# Altium schematic sheet Sheet1.SchDoc
size A4
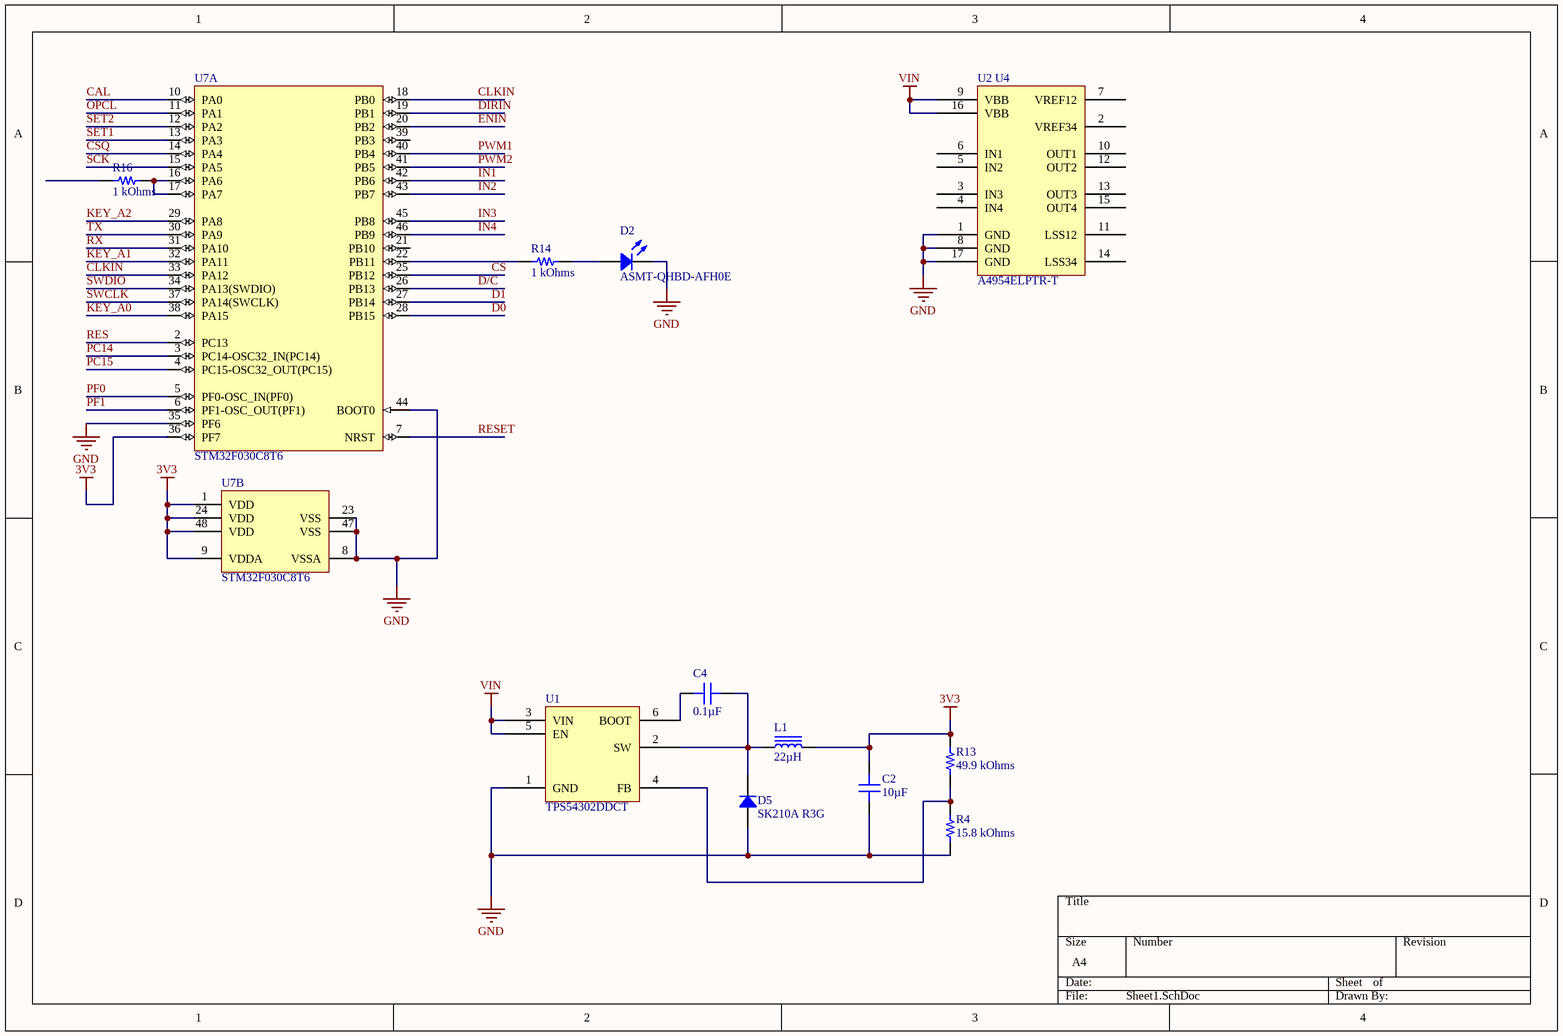
[diagram p0: Sheet1.SchDoc]

## Parts
C2  10µF  [CAP 0805_2012]
C4  0.1µF  [CAP 0805_2012]
D2  ASMT-QHBD-AFH0E  [Broadcom 4-PLLC 3228]
D5  SK210A R3G  [DO214AC SMA]
L1  22µH  [TDK VLCF4024-2]
R4  15.8 kOhms  [RES 0805_2012]
R13  49.9 kOhms  [RES 0805_2012]
R14  1 kOhms  [RES 0805_2012]
R16  1 kOhms  [RES 0805_2012]
U1  TPS54302DDCT  [TI SOT-23-6 DDC]
U2_U4  A4954ELPTR-T  [ALLEGRO TSSOP-16EP LP]
U7  STM32F030C8T6  [STM-LQFP48_N]  (parts A,B of 2)

## Nets
3V3: C2.2 L1.2 R13.2 U7.1(VDD) U7.9(VDDA) U7.24(VDD) U7.36(PF7) U7.48(VDD)
GND: C2.1 D2.2 D5.1 R4.1 U1.1(GND) U2_U4.1(GND) U2_U4.8(GND) U2_U4.17(GND) U7.8(VSSA) U7.23(VSS) U7.35(PF6) U7.44(BOOT0) U7.47(VSS)
VIN: U1.3(VIN) U1.5(EN) U2_U4.9(VBB) U2_U4.16(VBB)
CAL: U7.10(PA0)
CLKIN: U7.18(PB0) U7.33(PA12)
CS: U7.25(PB12)
CSQ: U7.14(PA4)
D0: U7.28(PB15)
D1: U7.27(PB14)
D/C: U7.26(PB13)
DIRIN: U7.19(PB1)
ENIN: U7.20(PB2)
IN1: U7.42(PB6)
IN2: U7.43(PB7)
IN3: U7.45(PB8)
IN4: U7.46(PB9)
KEY_A0: U7.38(PA15)
KEY_A1: U7.32(PA11)
KEY_A2: U7.29(PA8)
OPCL: U7.11(PA1)
PC14: U7.3(PC14-OSC32_IN(PC14))
PC15: U7.4(PC15-OSC32_OUT(PC15))
PF0: U7.5(PF0-OSC_IN(PF0))
PF1: U7.6(PF1-OSC_OUT(PF1))
PWM1: U7.40(PB4)
PWM2: U7.41(PB5)
RES: U7.2(PC13)
RESET: U7.7(NRST)
RX: U7.31(PA10)
SCK: U7.15(PA5)
SET1: U7.13(PA3)
SET2: U7.12(PA2)
SWCLK: U7.37(PA14(SWCLK))
SWDIO: U7.34(PA13(SWDIO))
TX: U7.30(PA9)
NetC4_1: C4.1 U1.6(BOOT)
NetC4_2: C4.2 D5.2 L1.1 U1.2(SW)
NetD2_1: D2.1 R14.2
NetR4_2: R4.2 R13.1 U1.4(FB)
NetR14_1: R14.1 U7.22(PB11)
NetR16_2: R16.2 U7.16(PA6) U7.17(PA7)

Not connected (* = marked no-connect by the designer): R16 1; U2_U4 2(VREF34) 3(IN3) 4(IN4) 5(IN2) 6(IN1) 7(VREF12) 10(OUT1) 11(LSS12) 12(OUT2) 13(OUT3) 14(LSS34) 15(OUT4); U7 21(PB10) 39(PB3)

## Library data of the parts
C2 = C2012JB1E106M085AC: CAP CER 10UF 25V JB 0805; Manufacturer: TDK Corporation; Tolerance: ±20%; Part Number: C2012JB1E106M085AC; Value: 10µF; Applications: General Purpose; Capacitance: 10µF; ComponentLink1Description: Datasheet; ComponentLink1URL: https://product.tdk.com/info/en/catalog/datasheets/mlcc_commercial_general_en.pdf?ref_disty=digikey; ComponentLink2Description: DigiKey Link; ComponentLink2URL: http://digikey.com/product-detail/en/tdk-corporation/C2012JB1E106M085AC/445-11464-1-ND/3953130; Device Package: 0805 (2012 Metric); Features: Low ESL; LastUpdated: 2. 09. 2020 01:04:29; Lifecycle Status: Active; Minimum Order: 1; Mounting Type: Surface Mount, MLCC; Operating Temperature: -25°C ~ 85°C; Package / Case: 0805 (2012 Metric); Packaging: TapeAndReel; PartId: 9643; Part Status: Active; Price: 0.15; Series: C; Size / Dimension: 0.079" L x 0.049" W (2.00mm x 1.25mm); Supplier 1: DigiKey; Supplier Part Number 1: 445-11464-1-ND; Temperature Coefficient: JB; Thickness (Max): 0.037" (0.95mm); Voltage - Rated: 25V
C4 = CC0805MRX7R9BB104: CAP CER 0.1UF 50V X7R 0805; Manufacturer: Yageo; Tolerance: ±20%; Part Number: CC0805MRX7R9BB104; Value: 0.1µF; Applications: General Purpose; Capacitance: 0.1µF; ComponentLink1Description: Datasheet; ComponentLink1URL: https://www.yageo.com/upload/media/product/productsearch/datasheet/mlcc/UPY-GPHC_X7R_6.3V-to-50V_18.pdf; ComponentLink2Description: DigiKey Link; ComponentLink2URL: http://digikey.com/product-detail/en/yageo/CC0805MRX7R9BB104/311-4351-1-ND/8025440; Device Package: 0805 (2012 Metric); LastUpdated: 2. 09. 2020 01:04:42; Lifecycle Status: Active; Minimum Order: 1; Mounting Type: Surface Mount, MLCC; Operating Temperature: -55°C ~ 125°C; Package / Case: 0805 (2012 Metric); Packaging: TapeAndReel; PartId: 2475; Part Status: Active; Price: 0.02; Series: CC; Size / Dimension: 0.079" L x 0.049" W (2.00mm x 1.25mm); Supplier 1: DigiKey; Supplier Part Number 1: 311-4351-1-ND; Temperature Coefficient: X7R; Thickness (Max): 0.037" (0.95mm); Voltage - Rated: 50V
D2 = ASMT-QHBD-AFH0E: LED INDICATOR 0.5W RED/ORN 4PLCC; Manufacturer: Broadcom Limited; Color: Red; Current - Max: 300mA; Current - Test: 150mA; Flux @ Current/Temperature - Test: 24lm (15lm ~ 33lm); Lumens/Watt @ Current - Test: 64 lm/W; Temperature - Test: 25°C; Viewing Angle: 120°; Voltage - Forward (Vf) (Typ): 2.5V; Wavelength: 618nm (611nm ~ 625nm); Part Number: ASMT-QHBD-AFH0E; ComponentLink1Description: Datasheet; ComponentLink1URL: https://docs.broadcom.com/docs/AV02-1841EN; ComponentLink2Description: DigiKey Link; ComponentLink2URL: http://digikey.com/product-detail/en/broadcom-limited/ASMT-QHBD-AFH0E/516-2951-1-ND/4240266; Device Package: 4-PLCC; Height - Seated (Max): 0.083" (2.10mm); LastUpdated: 24. 04. 2020 00:57:17; Lifecycle Status: Active; Minimum Order: 1; Mounting Type: Surface Mount; Package / Case: 4-PLCC; Packaging: TapeAndReel; Part Status: Active; Price: 0.42; Size / Dimension: 0.126" L x 0.110" W (3.20mm x 2.80mm); Supplier 1: DigiKey; Supplier Part Number 1: 516-2951-1-ND; Supplier Device Package: 4-PLCC
D5 = SK210A R3G: DIODE SCHOTTKY 100V 2A DO214AC; Manufacturer: Taiwan Semiconductor Corporation; Current - Reverse Leakage @ Vr: 100µA @ 100V; Speed: Fast Recovery =< 500ns, > 200mA (Io); Voltage - Forward (Vf) (Max) @ If: 850mV @ 2A; Part Number: SK210A R3G; ComponentLink1Description: Datasheet; ComponentLink1URL: https://www.taiwansemi.com/products/datasheet/SK22A%20SERIES_P15.pdf; ComponentLink2Description: DigiKey Link; ComponentLink2URL: http://digikey.com/product-detail/en/taiwan-semiconductor-corporation/SK210A-R3G/SK210AR3GCT-ND/7358622; Current - Average Rectified (Io): 2A; Diode Type: Schottky; LastUpdated: 2. 09. 2020 01:19:02; Lifecycle Status: Active; Minimum Order: 1; Mounting Type: Surface Mount; Operating Temperature - Junction: -55°C ~ 150°C; Package / Case: DO-214AC, SMA; Packaging: TapeAndReel; PartId: 2157; Part Status: Active; Price: 0.11; Series: -; Supplier 1: DigiKey; Supplier Part Number 1: SK210AR3GCT-ND; Supplier Device Package: DO-214AC (SMA); Voltage - DC Reverse (Vr) (Max): 100V
L1 = VLCF5024T-220MR59-2: FIXED IND 22UH 590MA 188 MOHM; Manufacturer: TDK Corporation; DC Resistance (DCR): 188mOhm Max; Inductance Frequency - Test: 100kHz; Material - Core: Ferrite; Shielding: Shielded; Tolerance: ±20%; Type: Wirewound; Part Number: VLCF5024T-220MR59-2; ComponentLink1Description: Datasheet; ComponentLink1URL: https://product.tdk.com/info/en/catalog/datasheets/inductor_commercial_power_vlcf5024-2_en.pdf?ref_disty=digikey; ComponentLink2Description: DigiKey Link; ComponentLink2URL: http://digikey.com/product-detail/en/tdk-corporation/VLCF5024T-220MR59-2/445-8743-1-ND/3083314; Current Rating (Amps): 590mA; Current - Saturation: 590mA; Device Package: Nonstandard; Height - Seated (Max): 0.094" (2.40mm); Inductance: 22µH; LastUpdated: 2. 09. 2020 01:22:15; Lifecycle Status: Active; Minimum Order: 1; Mounting Type: Surface Mount; Operating Temperature: -40°C ~ 105°C; Package / Case: Nonstandard; Packaging: TapeAndReel; PartId: 162; Part Status: Active; Price: 0.63; Series: VLCF; Size / Dimension: 0.197" L x 0.197" W (5.00mm x 5.00mm); Supplier 1: DigiKey; Supplier Part Number 1: 445-8743-1-ND; Value: 22µH
R4 = ERA-6AEB1582V: RES 15.8K OHM 0.1% 1/8W 0805; Manufacturer: Panasonic Electronic Components; Power (Watts): 0.125W, 1/8W; Temperature Coefficient: ±25ppm/°C; Part Number: ERA-6AEB1582V; Value: 15.8 kOhms; ComponentLink1Description: Datasheet; ComponentLink1URL: https://industrial.panasonic.com/cdbs/www-data/pdf/RDM0000/AOA0000C307.pdf; ComponentLink2Description: DigiKey Link; ComponentLink2URL: http://digikey.com/product-detail/en/panasonic-electronic-components/ERA-6AEB1582V/P15.8KDACT-ND/3074972; Composition: Thin Film; Device Package: 0805 (2012 Metric); Features: Automotive AEC-Q200; Height - Seated (Max): 0.024" (0.60mm); LastUpdated: 2. 09. 2020 01:15:23; Lifecycle Status: Active; Minimum Order: 1; Number of Terminations: 2; Operating Temperature: -55°C ~ 155°C; Package / Case: 0805 (2012 Metric); Packaging: TapeAndReel; PartId: 28189; Part Status: Active; Price: 0.04; Ratings: AEC-Q200; Resistance: 15.8 kOhms; Series: ERA-6A; Size / Dimension: 0.079" L x 0.049" W (2.00mm x 1.25mm); Supplier 1: DigiKey; Supplier Part Number 1: P15.8KDACT-ND; Supplier Device Package: 0805; Tolerance: ±0.1%
R13 = 6-2176093-6: RES SMD 49.9K OHM 0.1% 1/4W 0805; Manufacturer: TE Connectivity Passive Product; Power (Watts): 0.25W, 1/4W; Temperature Coefficient: ±25ppm/°C; Part Number: 6-2176093-6; Value: 49.9 kOhms; ComponentLink1Description: Datasheet; ComponentLink1URL: https://www.te.com/commerce/DocumentDelivery/DDEController?Action=srchrtrv&DocNm=1773272&DocType=DS&DocLang=English; ComponentLink2Description: DigiKey Link; ComponentLink2URL: http://digikey.com/product-detail/en/te-connectivity-passive-product/6-2176093-6/A110706CT-ND/4035061; Composition: Thin Film; Device Package: 0805 (2012 Metric); Height - Seated (Max): 0.026" (0.65mm); LastUpdated: 2. 09. 2020 01:15:22; Lifecycle Status: Active; Minimum Order: 1; Number of Terminations: 2; Operating Temperature: -55°C ~ 155°C; Package / Case: 0805 (2012 Metric); Packaging: TapeAndReel; PartId: 28500; Part Status: Active; Price: 0.14; Resistance: 49.9 kOhms; Series: RP73P, Holsworthy; Size / Dimension: 0.079" L x 0.049" W (2.00mm x 1.25mm); Supplier 1: DigiKey; Supplier Part Number 1: A110706CT-ND; Supplier Device Package: 0805; Tolerance: ±0.1%
R14 R16 = CPF0805B1K0E: RES SMD 1K OHM 0.1% 1/10W 0805; Manufacturer: TE Connectivity Passive Product; Power (Watts): 0.1W, 1/10W; Temperature Coefficient: ±25ppm/°C; Part Number: CPF0805B1K0E; Value: 1 kOhms; ComponentLink1Description: Datasheet; ComponentLink1URL: https://www.te.com/commerce/DocumentDelivery/DDEController?Action=srchrtrv&DocNm=1773200&DocType=DS&DocLang=English; ComponentLink2Description: DigiKey Link; ComponentLink2URL: http://digikey.com/product-detail/en/te-connectivity-passive-product/CPF0805B1K0E/A106044CT-ND/3477681; Composition: Thin Film; Device Package: 0805 (2012 Metric); Height - Seated (Max): 0.026" (0.65mm); LastUpdated: 2. 09. 2020 01:15:24; Lifecycle Status: Active; Minimum Order: 1; Number of Terminations: 2; Operating Temperature: -55°C ~ 155°C; Package / Case: 0805 (2012 Metric); Packaging: TapeAndReel; PartId: 27725; Part Status: Active; Price: 0.09; Resistance: 1 kOhms; Series: CPF, Neohm; Size / Dimension: 0.079" L x 0.049" W (2.00mm x 1.25mm); Supplier 1: DigiKey; Supplier Part Number 1: A106044CT-ND; Supplier Device Package: 0805; Tolerance: ±0.1%
U1 = TPS54302DDCT: IC REG BUCK ADJ 3A TSOT23-6; Manufacturer: Texas Instruments; Frequency - Switching: 400kHz; Function: Step-Down; Number of Outputs: 1; Output Configuration: Positive; Output Type: Adjustable; Synchronous Rectifier: Yes; Voltage - Input (Max): 28V; Voltage - Input (Min): 4.5V; Voltage - Output (Min/Fixed): 0.596V; Part Number: TPS54302DDCT; ComponentLink1Description: Datasheet; ComponentLink1URL: http://www.ti.com/general/docs/suppproductinfo.tsp?distId=10&gotoUrl=http%3A%2F%2Fwww.ti.com%2Flit%2Fgpn%2Ftps54302; ComponentLink2Description: DigiKey Link; ComponentLink2URL: http://digikey.com/product-detail/en/texas-instruments/TPS54302DDCT/296-44542-1-ND/6128450; Current - Output: 3A; Device Package: SOT-23-6 Thin, TSOT-23-6; LastUpdated: 4. 02. 2020 14:31:43; Lifecycle Status: Active; Minimum Order: 1; Mounting Type: Surface Mount; Operating Temperature: -40°C ~ 125°C (TJ); Package / Case: SOT-23-6 Thin, TSOT-23-6; Packaging: TapeAndReel; Part Status: Active; Price: 1.06; Series: -; Supplier 1: DigiKey; Supplier Part Number 1: 296-44542-1-ND; Supplier Device Package: TSOT-23-6; Topology: Buck; Voltage - Output (Max): 28V
U2_U4 = A4954ELPTR-T: IC MOTOR DRIVER 8V-40V 16TSSOP; Manufacturer: Allegro MicroSystems; Current - Output: 2A; Function: Driver - Fully Integrated, Control and Power Stage; Interface: Parallel; Motor Type - AC, DC: Brushed DC; Output Configuration: Half Bridge (4); Voltage - Load: 8V ~ 40V; Part Number: A4954ELPTR-T; Applications: General Purpose; ComponentLink1Description: Datasheet; ComponentLink1URL: https://www.allegromicro.com/~/media/Files/Datasheets/A4954-Datasheet.ashx; ComponentLink2Description: DigiKey Link; ComponentLink2URL: //digikey.com/product-detail/en/allegro-microsystems/A4954ELPTR-T/620-1384-2-ND/2509910; Device Package: 16-TSSOP (0.173", 4.40mm Width) Exposed Pad; LastUpdated: 4. 12. 2019 01:03:30; Lifecycle Status: 0; Minimum Order: 1; Mounting Type: Surface Mount; Operating Temperature: -40°C ~ 150°C (TJ); Package / Case: 16-TSSOP (0.173", 4.40mm Width) Exposed Pad; Packaging: TapeAndReel; PartId: 8; Part Status: Active; Price: 1.38; Series: -; Supplier 1: DigiKey; Supplier Part Number 1: 620-1384-2-ND; Supplier Device Package: 16-TSSOP-EP; Technology: DMOS; Voltage - Supply: 8V ~ 40V
U7 = STM32F030C8T6: ARM Cortex-M0 32-bit MCU, 64 KB Flash, 8 KB Internal RAM, 39 I/Os, 48-pin LQFP, -40 to 85 degC, Tray; FLASH Size (Prog) (kB): 64; I/Os (High Current): 39; Internal RAM Size (kB): 8; Operating Frequency(F) (Processor speed) (MHz): 48; Supply Voltage(Vcc) min (V): 2.4; DatasheetVersion: Rev. 1; PackageVersion: Rev. 6, 06/2013; PackageReference: LQFP48; PackageDescription: 48-Pin Low Profile Quad Flat Package, 7 x 7 mm Body, 0.5 mm Pitch; Supplier 1: Digi-Key; Supplier Part Number 1: 497-14043-ND; Supplier 2: Newark; Supplier Part Number 2: 06X3647; Supplier 3: Mouser; Supplier Part Number 3: 511-STM32F030C8T6; Core: ARM Cortex-M0; Packing: Tray; Mounting Technology: Surface Mount; PartNumber: STM32F030C8T6; ComponentLink1Description: Manufacturer URL; ComponentLink1URL: http://www.st.com/web/en/home.html; ComponentLink2Description: Datasheet; ComponentLink2URL: http://www.st.com/st-web-ui/static/active/en/resource/technical/document/datasheet/DM00088500.pdf; ComponentLink3Description: Package Specification; ComponentLink3URL: http://www.st.com/st-web-ui/static/active/en/resource/technical/document/datasheet/DM00058181.pdf